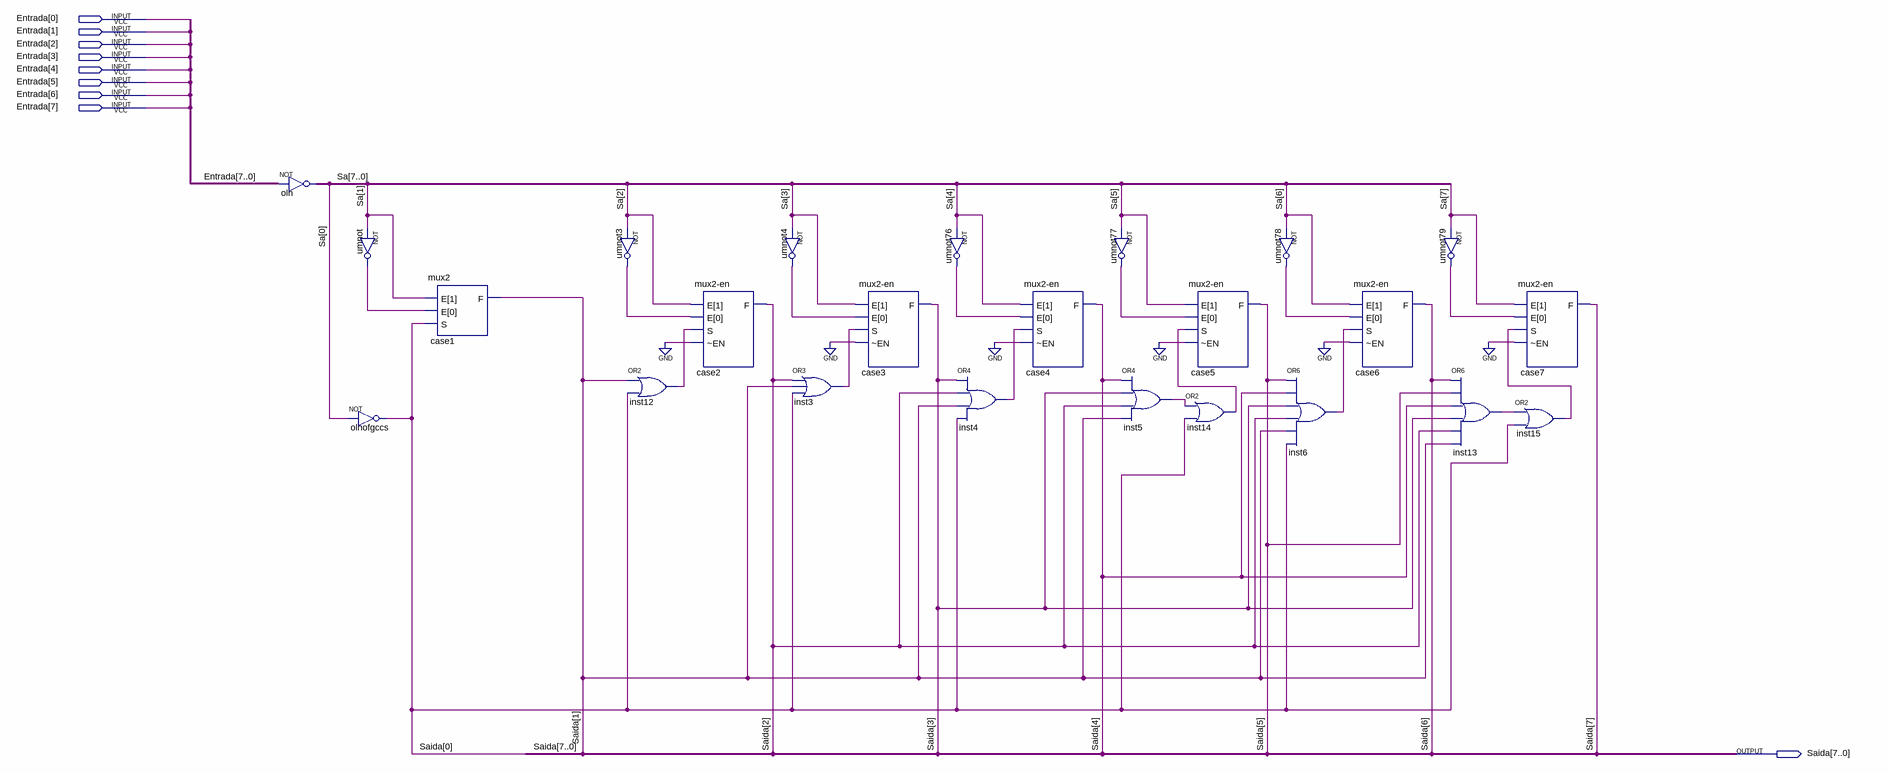
[diagram p0: schematic sheet]
// Quartus schematic neg-pos.bdf as structural Verilog: 24 symbols, 9 pins
module \neg-pos  (
  input  [7:0] Entrada,
  output [7:0] Saida
);

  wire inst3_out, inst4_out, inst5_out, inst6_out, inst12_out, inst13_out, inst14_out, inst15_out,
       umnot3_out, umnot4_out, umnot76_out, umnot77_out, umnot78_out, umnot79_out, umnot_out;
  wire [7:0] Sa;

  assign Sa = ~Entrada;  // NOT olh, 8 bits wide
  not umnot (umnot_out, Sa[1]);
  not olhofgccs (Saida[0], Sa[0]);
  mux2 case1 (.E({Sa[1], umnot_out}), .S(Saida[0]), .F(Saida[1]));
  not umnot3 (umnot3_out, Sa[2]);
  or inst12 (inst12_out, Saida[1], Saida[0]);
  \mux2-en  case2 (.E({Sa[2], umnot3_out}), .S(inst12_out), .\~EN (1'b0), .F(Saida[2]));
  not umnot4 (umnot4_out, Sa[3]);
  or inst3 (inst3_out, Saida[2], Saida[1], Saida[0]);
  \mux2-en  case3 (.E({Sa[3], umnot4_out}), .S(inst3_out), .\~EN (1'b0), .F(Saida[3]));
  not umnot76 (umnot76_out, Sa[4]);
  or inst4 (inst4_out, Saida[3], Saida[2], Saida[1], Saida[0]);
  \mux2-en  case4 (.E({Sa[4], umnot76_out}), .S(inst4_out), .\~EN (1'b0), .F(Saida[4]));
  not umnot77 (umnot77_out, Sa[5]);
  or inst5 (inst5_out, Saida[4], Saida[3], Saida[2], Saida[1]);
  \mux2-en  case5 (.E({Sa[5], umnot77_out}), .S(inst14_out), .\~EN (1'b0), .F(Saida[5]));
  or inst14 (inst14_out, inst5_out, Saida[0]);
  not umnot78 (umnot78_out, Sa[6]);
  or inst6 (inst6_out, Saida[5], Saida[4], Saida[3], Saida[2], Saida[1], Saida[0]);
  \mux2-en  case6 (.E({Sa[6], umnot78_out}), .S(inst6_out), .\~EN (1'b0), .F(Saida[6]));
  not umnot79 (umnot79_out, Sa[7]);
  or inst13 (inst13_out, Saida[6], Saida[5], Saida[4], Saida[3], Saida[2], Saida[1]);
  \mux2-en  case7 (.E({Sa[7], umnot79_out}), .S(inst15_out), .\~EN (1'b0), .F(Saida[7]));
  or inst15 (inst15_out, inst13_out, Saida[0]);
endmodule
